# EAGLE design polarshield_eagle1.5_auto (EAGLE 5.11)
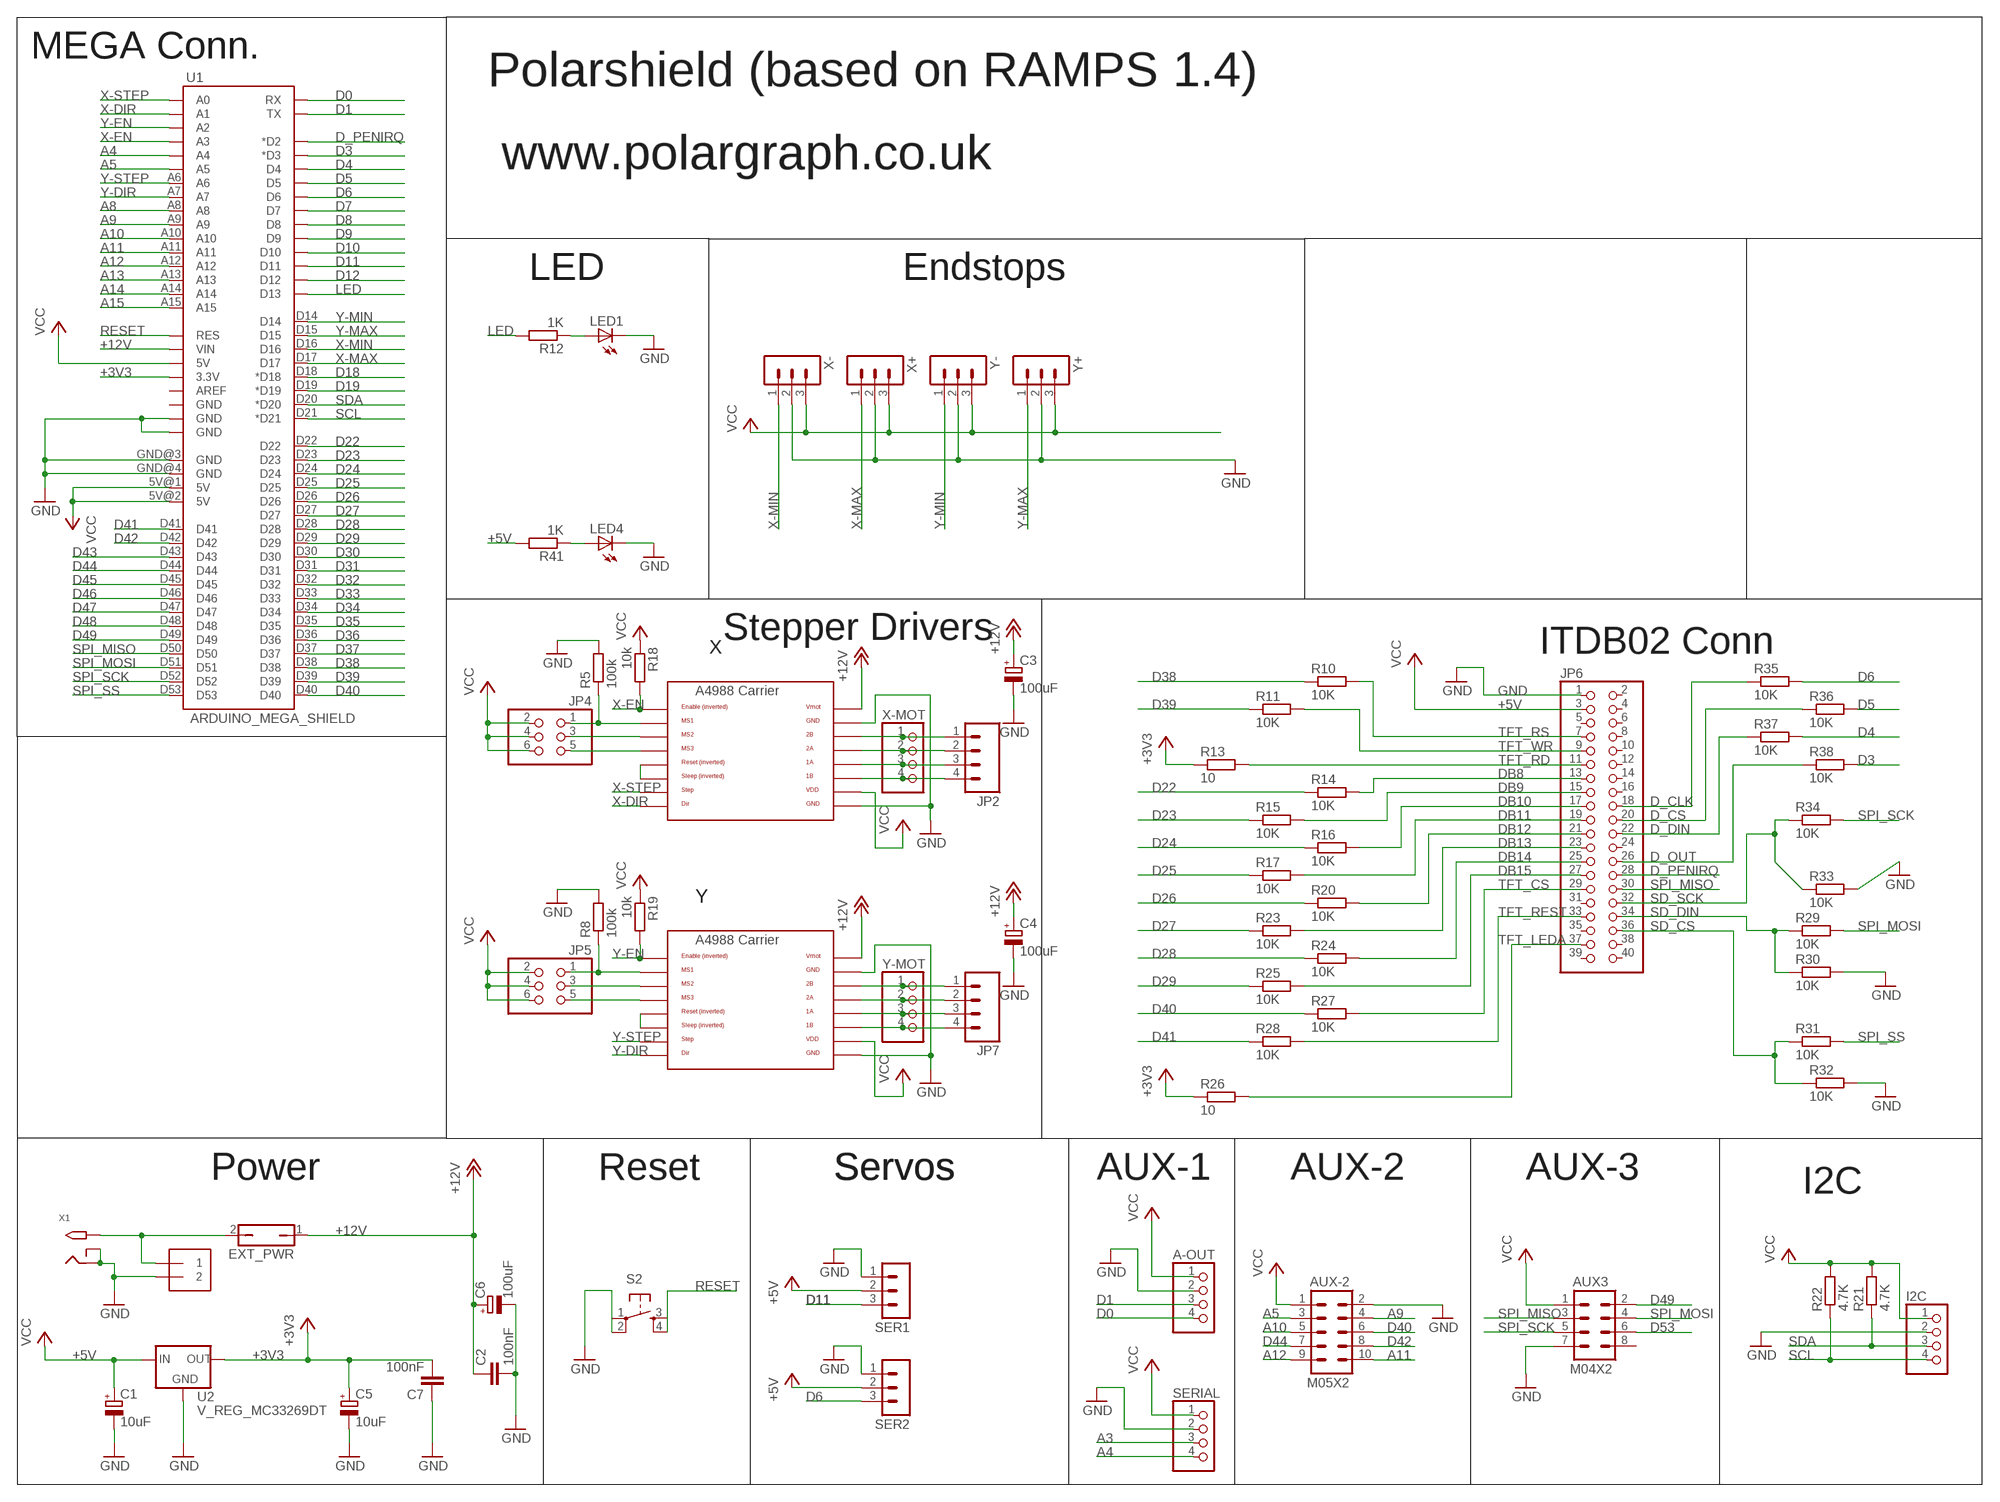
[diagram p0: schematic, sheet 1, part 1 of 2]
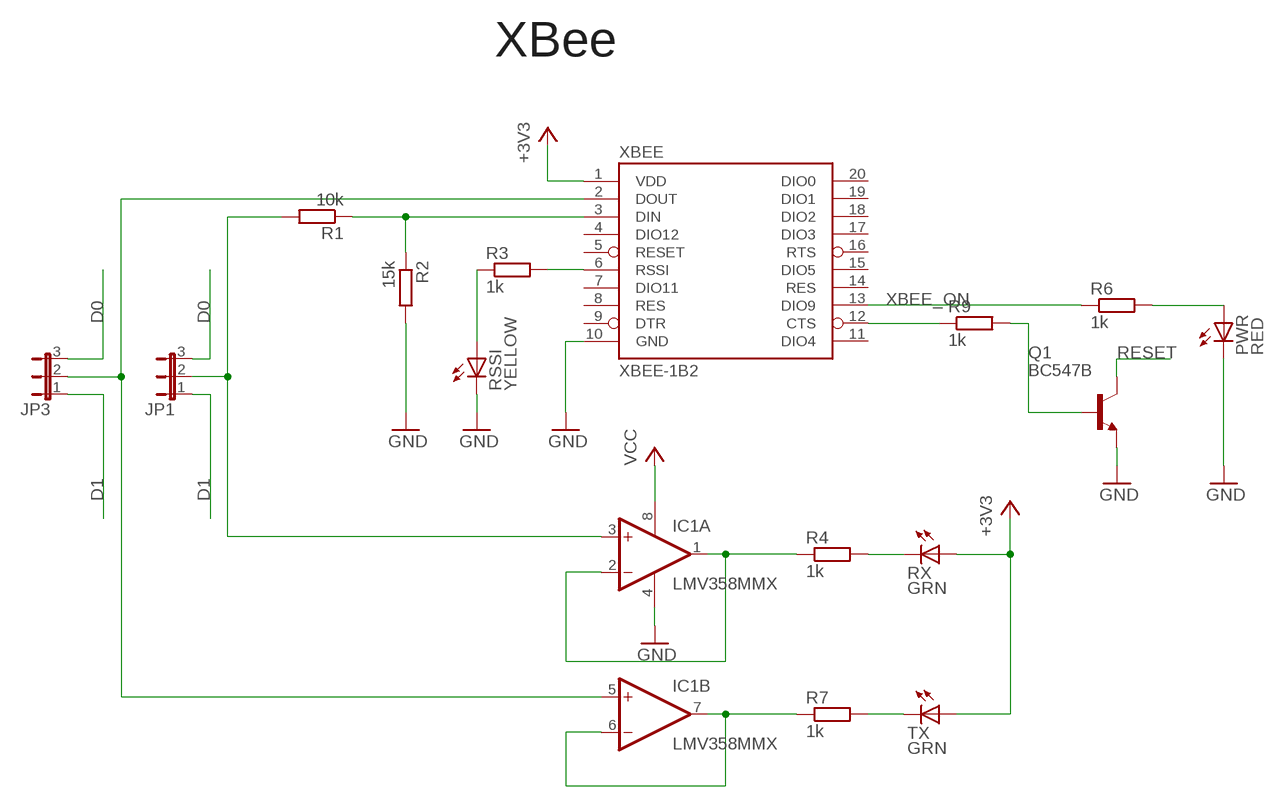
[diagram p1: schematic, sheet 1, part 2 of 2]

## Parts
A-OUT  PINHD-1X4  [1X04]
AUX3  M04X2  [2X4]
AUX-2  M05X2  [2X5]
C1  10uF  CPOL-EUCT7343  [CT7343]
C2  100nF  C-EUC0805  [C0805]
C3  100uF  CPOL-EU153CLV-0605  [153CLV-0605]
C4  100uF  CPOL-EU153CLV-0605  [153CLV-0605]
C5  10uF  CPOL-EUCT7343  [CT7343]
C6  100uF  CPOL-EU153CLV-0605  [153CLV-0605]
C7  100nF  C-EUC0805  [C0805]
EXT_PWR  JP1Q  [JP1]
I2C  PINHD-1X4  [1X04]
IC1  LMV358MMX  [MSOP08]
J1  1X2-3.5MM  [1X2-3.5MM]
JP1  JP2E  [JP2]
JP2  M04SCREW  [SCREWTERMINAL-3.5MM-4]
JP3  JP2E  [JP2]
JP4  PINHD-2X3  [2X03]
JP5  PINHD-2X3  [2X03]
JP6  PINHD-2X20  [2X20]
JP7  M04SCREW  [SCREWTERMINAL-3.5MM-4]
LED1  LEDCHIP-LED0805  [CHIP-LED0805]
LED4  LEDCHIP-LED0805  [CHIP-LED0805]
PWR  RED  LEDCHIPLED_0805  [CHIPLED_0805]
Q1  BC547B  [TO92]
R1  10k  R-EU_R0805  [R0805]
R2  15k  R-EU_R0805  [R0805]
R3  1k  R-EU_R0805  [R0805]
R4  1k  R-EU_R0805  [R0805]
R5  100k  R-EU_R0805  [R0805]
R6  1k  R-EU_R0805  [R0805]
R7  1k  R-EU_R0805  [R0805]
R8  100k  R-EU_R0805  [R0805]
R9  1k  R-EU_R0805  [R0805]
R10  10K  R-EU_R0805  [R0805]
R11  10K  R-EU_R0805  [R0805]
R12  1K  R-EU_R0805  [R0805]
R13  10  R-EU_R0805  [R0805]
R14  10K  R-EU_R0805  [R0805]
R15  10K  R-EU_R0805  [R0805]
R16  10K  R-EU_R0805  [R0805]
R17  10K  R-EU_R0805  [R0805]
R18  10k  R-EU_R0805  [R0805]
R19  10k  R-EU_R0805  [R0805]
R20  10K  R-EU_R0805  [R0805]
R21  4.7K  R-EU_R0805  [R0805]
R22  4.7K  R-EU_R0805  [R0805]
R23  10K  R-EU_R0805  [R0805]
R24  10K  R-EU_R0805  [R0805]
R25  10K  R-EU_R0805  [R0805]
R26  10  R-EU_R0805  [R0805]
R27  10K  R-EU_R0805  [R0805]
R28  10K  R-EU_R0805  [R0805]
R29  10K  R-EU_R0805  [R0805]
R30  10K  R-EU_R0805  [R0805]
R31  10K  R-EU_R0805  [R0805]
R32  10K  R-EU_R0805  [R0805]
R33  10K  R-EU_R0805  [R0805]
R34  10K  R-EU_R0805  [R0805]
R35  10K  R-EU_R0805  [R0805]
R36  10K  R-EU_R0805  [R0805]
R37  10K  R-EU_R0805  [R0805]
R38  10K  R-EU_R0805  [R0805]
R41  1K  R-EU_R0805  [R0805]
RSSI  YELLOW  LEDCHIPLED_0805  [CHIPLED_0805]
RX  GRN  LEDCHIPLED_0805  [CHIPLED_0805]
S2  TAC_SWITCHPTH  [TACTILE-PTH]
SER1  3PIN-HEADER  [3PIN-HEADER]
SER2  3PIN-HEADER  [3PIN-HEADER]
SERIAL  PINHD-1X4  [1X04]
TX  GRN  LEDCHIPLED_0805  [CHIPLED_0805]
U1  ARDUINO_MEGA_SHIELD  [ARDUINO_MEGA_SHIELD]
U2  V_REG_MC33269DT  [DPAK]
U$6  A4988BREAKOUT  [A4988BREAKOUT]
U$7  A4988BREAKOUT  [A4988BREAKOUT]
X1  2.1MMJACKTHM  [PJ-102A]
X+  3PIN-HEADER  [3PIN-HEADER]
X-  3PIN-HEADER  [3PIN-HEADER]
X-MOT  PINHD-1X4  [1X04]
XBEE  XBEE-1B2  [XBEE-SILK]
Y+  3PIN-HEADER  [3PIN-HEADER]
Y-  3PIN-HEADER  [3PIN-HEADER]
Y-MOT  PINHD-1X4  [1X04]

## Nets
+3V3: C5.+ C7.2 R13.1 R26.1 RX.A TX.A U1.3.3V U2.4(OUT) XBEE.1(VDD)
+5V: A-OUT.1 AUX3.1 AUX-2.1 C1.+ I2C.1 IC1.8(P:V+) JP4.2 JP4.4 JP4.6 JP5.2 JP5.4 JP5.6 JP6.3 R18.1 R19.1 R21.2 R22.2 R41.2 SER1.2 SER2.2 SERIAL.1 U1.5V@0(5V) U1.5V@1(5V) U1.5V@2(5V) U2.3(IN) U$6.VDD U$7.VDD X+.3 X-.3 Y+.3 Y-.3 ; supply symbol labelled VCC
+12V: C2.1 C3.+ C4.+ C6.+ EXT_PWR.1 U1.VIN U$6.VMOT U$7.VMOT
A3: SERIAL.3
A4: SERIAL.4 U1.A4
A5: AUX-2.3 U1.A5
A8: U1.A8
A9: AUX-2.4 U1.A9
A10: AUX-2.5 U1.A10
A11: AUX-2.10 U1.A11
A12: AUX-2.9 U1.A12
A13: U1.A13
A14: U1.A14
A15: U1.A15
D0: A-OUT.4 JP1.3 JP3.3 U1.RX
D1: A-OUT.3 JP1.1 JP3.1 U1.TX
D3: R38.2 U1.D3(*D3)
D4: R37.2 U1.D4
D5: R36.2 U1.D5
D6: R35.2 SER2.3 U1.D6
D7: U1.D7
D8: U1.D8
D9: U1.D9
D10: U1.D10
D11: SER1.3 U1.D11
D12: U1.D12
D18: U1.D18(*D18)
D19: U1.D19(*D19)
D22: R14.1 U1.D22
D23: R15.1 U1.D23
D24: R16.1 U1.D24
D25: R17.1 U1.D25
D26: R20.1 U1.D26
D27: R23.1 U1.D27
D28: R24.1 U1.D28
D29: R25.1 U1.D29
D30: U1.D30
D31: U1.D31
D32: U1.D32
D33: U1.D33
D34: U1.D34
D35: U1.D35
D36: U1.D36
D37: U1.D37
D38: R10.1 U1.D38
D39: R11.1 U1.D39
D40: AUX-2.6 R27.1 U1.D40
D41: R28.1 U1.D41
D42: AUX-2.8 U1.D42
D43: U1.D43
D44: AUX-2.7 U1.D44
D45: U1.D45
D46: U1.D46
D47: U1.D47
D48: U1.D48
D49: AUX3.2 U1.D49
D53: AUX3.6
D_CLK: JP6.18 R35.1
D_CS: JP6.20 R36.1
D_DIN: JP6.22 R37.1
D_OUT: JP6.26 R38.1
D_PENIRQ: JP6.28 U1.D2(*D2)
DB8: JP6.13 R14.2
DB9: JP6.15 R15.2
DB10: JP6.17 R16.2
DB11: JP6.19 R17.2
DB12: JP6.21 R20.2
DB13: JP6.23 R23.2
DB14: JP6.25 R24.2
DB15: JP6.27 R25.2
GND: A-OUT.2 AUX3.7 AUX-2.2 C1.- C2.2 C3.- C4.- C5.- C6.- C7.1 I2C.2 IC1.4(P:V-) J1.2 JP6.1 LED1.C LED4.C PWR.C Q1.1(E) R2.2 R5.2 R8.2 R30.2 R32.2 R33.2 RSSI.C S2.1 S2.2 SER1.1 SER2.1 SERIAL.2 U1.GND@0(GND) U1.GND@1(GND) U1.GND@3(GND) U1.GND@4(GND) U2.1(GND) U$6.GND U$6.GND@0(GND) U$7.GND U$7.GND@0(GND) X1.RING X1.RING_SW X+.2 X-.2 XBEE.10(GND) Y+.2 Y-.2
LED: R12.2 U1.D13
N$2: LED4.A R41.1
N$3: EXT_PWR.2 J1.1 X1.TIP
N$4: R7.2 TX.C
N$5: R3.1 RSSI.A
N$6: IC1.6(B:-IN) IC1.7(B:OUT) R7.1
N$7: PWR.A R6.2
N$8: R3.2 XBEE.6(RSSI)
N$9: IC1.1(A:OUT) IC1.2(A:-IN) R4.1
N$10: R9.1 XBEE.12(CTS)
N$11: R4.2 RX.C
N$12: Q1.2(B) R9.2
N$14: JP4.1 R5.1 U$6.MS1
N$15: JP4.3 U$6.MS2
N$16: IC1.3(A:+IN) JP1.2 R1.2
N$17: JP5.3 U$7.MS2
N$19: JP4.5 U$6.MS3
N$20: U$6.RST U$6.SLP(SLEEP)
N$21: JP2.1 U$6.2B X-MOT.1
N$22: JP2.2 U$6.2A X-MOT.2
N$23: U$7.RST U$7.SLP(SLEEP)
N$24: IC1.5(B:+IN) JP3.2 XBEE.2(DOUT)
N$26: JP2.3 U$6.1A X-MOT.3
N$27: JP2.4 U$6.1B X-MOT.4
N$28: JP7.1 U$7.2B Y-MOT.1
N$29: JP7.2 U$7.2A Y-MOT.2
N$30: JP7.3 U$7.1A Y-MOT.3
N$31: JP5.5 U$7.MS3
N$32: R1.1 R2.1 XBEE.3(DIN)
N$33: JP5.1 R8.1 U$7.MS1
N$36: JP7.4 U$7.1B Y-MOT.4
N$46: LED1.A R12.1
RESET: Q1.3(C) S2.3 S2.4 U1.RES
SCL: I2C.4 R22.1 U1.D21(*D21)
SD_CS: JP6.36 R31.1 R32.1
SD_DIN: JP6.34 R29.1 R30.1
SD_SCK: JP6.32 R33.1 R34.1
SDA: I2C.3 R21.1 U1.D20(*D20)
SPI_MISO: AUX3.3 JP6.30 U1.D50
SPI_MOSI: AUX3.4 R29.2 U1.D51
SPI_SCK: AUX3.5 R34.2 U1.D52
SPI_SS: R31.2 U1.D53
TFT_CS: JP6.29 R27.2
TFT_LEDA: JP6.37 R26.2
TFT_RD: JP6.11 R13.2
TFT_REST: JP6.33 R28.2
TFT_RS: JP6.7 R10.2
TFT_WR: JP6.9 R11.2
X-DIR: U1.A1 U$6.DIR
X-EN: R18.2 U1.A3 U$6.EN
X-MAX: U1.D17 X+.1
X-MIN: U1.D16 X-.1
X-STEP: U1.A0 U$6.STEP
XBEE_ON: R6.1 XBEE.13(DIO9)
Y-DIR: U1.A7 U$7.DIR
Y-EN: R19.2 U1.A2 U$7.EN
Y-MAX: U1.D15 Y+.1
Y-MIN: U1.D14 Y-.1
Y-STEP: U1.A6 U$7.STEP
Unconnected: AUX3.8 JP6.2 JP6.4 JP6.5 JP6.6 JP6.8 JP6.10 JP6.12 JP6.14 JP6.16 JP6.24 JP6.31 JP6.35 JP6.38 JP6.39 JP6.40 U1.AREF U1.GND@2(GND) XBEE.4(DIO12) XBEE.5(RESET) XBEE.7(DIO11) XBEE.8(RES) XBEE.9(DTR) XBEE.11(DIO4) XBEE.14(RES) XBEE.15(DIO5) XBEE.16(RTS) XBEE.17(DIO3) XBEE.18(DIO2) XBEE.19(DIO1) XBEE.20(DIO0)

## Notes on the sheet
- MEGA Conn.
- Polarshield (based on RAMPS 1.4)
- www.polargraph.co.uk
- LED | Endstops
- XBee
- Stepper Drivers
- X | ITDB02 Conn
- Y
- Power | Reset | Servos | Servos | AUX-1 | AUX-2 | AUX-3
- I2C

## Library data of the parts
A-OUT I2C SERIAL X-MOT Y-MOT = RepRapjr:PINHD-1X4: PIN HEADER
AUX3 = SparkFun:M04X2
AUX-2 = RepRapjr:M05X2
C1 C3-C6 = rcl:CPOL-EU: POLARIZED CAPACITOR, European symbol
C2 C7 = resistor:C-EU: CAPACITOR, European symbol
EXT_PWR = jumper:JP1Q: JUMPER
IC1 = linear:LMV358?*: Dual General Purpose, Low Voltage, Rail-to-Rail Output Operational Amplifiers Source: http://www.national.com/mpf/LM/LMV321.html http://www.national.com/dt/lmv_qual.pdf
J1 = adafruit:1X2: 3.5mm Terminal block http://www.ladyada.net/library/pcb/eaglelibrary.html
JP1 JP3 = jumper:JP2E: JUMPER
JP2 JP7 = SparkFun:M04: Header 4 Standard 4-pin 0.1" header. Use with straight break away headers (SKU : PRT-00116), right angle break away headers (PRT-00553), swiss pins (PRT-00743), machine pins (PRT-00117), and female headers (PRT-00115). Molex polarized connector foot print use with SKU : PRT-08231 with associated crimp pins and housings. 1MM SMD Version SKU: PRT-10208
JP4 JP5 = pinhead:PINHD-2X3: PIN HEADER
JP6 = pinhead:PINHD-2X20: PIN HEADER
LED1 LED4 PWR RSSI RX TX = led:LED: LED OSRAM: - CHIPLED LG R971, LG N971, LY N971, LG Q971, LY Q971, LO R971, LY R971 LH N974, LH R974 LS Q976, LO Q976, LY Q976 LO Q996 - Hyper CHIPLED LW Q18S LB Q993, LB Q99A, LB R99A - SideLED LS A670, LO A670, LY A670, LG A670, LP A670 LB A673, LV A673, LT A673, LW A673 LH A674 LY A675 LS A676, LA A676, LO A676, LY A676, LW A676 LS A679, LY A679, LG A679 - Hyper Micro SIDELED® LS Y876, LA Y876, LO Y876, LY Y876 LT Y87S - SmartLED LW L88C, LW L88S LB L89C, LB L89S, LG L890 LS L89K, LO L89K, LY L89K LS L896, LA L896, LO L896, LY L896 - TOPLED LS T670, LO T670, LY T670, LG T670, LP T670 LSG T670, LSP T670, LSY T670, LOP T670, LYG T670 LG T671, LOG T671, LSG T671 LB T673, LV T673, LT T673, LW T673 LH T674 LS T676, LA T676, LO T676, LY T676, LB T676, LH T676, LSB T676, LW T676 LB T67C, LV T67C, LT T67C, LS T67K, LO T67K, LY T67K, LW E67C LS E67B, LA E67B, LO E67B, LY E67B, LB E67C, LV E67C, LT E67C LW T67C LS T679, LY T679, LG T679 LS T770, LO T770, LY T770, LG T770, LP T770 LB T773, LV T773, LT T773, LW T773 LH T774 LS E675, LA E675, LY E675, LS T675 LS T776, LA T776, LO T776, LY T776, LB T776 LHGB T686 LT T68C, LB T68C - Hyper Mini TOPLED® LB M676 - Mini TOPLED Santana® LG M470 LS M47K, LO M47K, LY M47K Source: http://www.osram.convergy.de LUXEON: - LUMILED® LXK2-PW12-R00, LXK2-PW12-S00, LXK2-PW14-U00, LXK2-PW14-V00 LXK2-PM12-R00, LXK2-PM12-S00, LXK2-PM14-U00 LXK2-PE12-Q00, LXK2-PE12-R00, LXK2-PE12-S00, LXK2-PE14-T00, LXK2-PE14-U00 LXK2-PB12-K00, LXK2-PB12-L00, LXK2-PB12-M00, LXK2-PB14-N00, LXK2-PB14-P00, LXK2-PB14-Q00 LXK2-PR12-L00, LXK2-PR12-M00, LXK2-PR14-Q00, LXK2-PR14-R00 LXK2-PD12-Q00, LXK2-PD12-R00, LXK2-PD12-S00 LXK2-PH12-R00, LXK2-PH12-S00 LXK2-PL12-P00, LXK2-PL12-Q00, LXK2-PL12-R00 Source: www.luxeon.com KINGBRIGHT: KA-3528ASYC Source: www.kingbright.com
Q1 = transistor-npn:BC547*: NPN Transistor
R1 R2 R5 R8 R12 R18 R19 R21 R22 R41 = rcl:R-EU_: RESISTOR, European symbol
R3 R4 R6 R7 R9-R11 R13-R17 R20 R23-R38 = resistor:R-EU_: RESISTOR, European symbol
S2 = SparkFun:TAC_SWITCH: Momentary Switch Button commonly used for reset or general input. Spark Fun Electronics SKU : COM-00097
SER1 SER2 X+ X- Y+ Y- = ultimachine:3PIN-HEADER: PIN HEADER
U1 = RepRapjr:ARDUINO_MEGA_SHIELD
U2 = SparkFun:V_REG_MC33269
U$6 U$7 = RepRapjr:A4988BREAKOUT
X1 = adafruit:2.1MMJACK: 2.1mm x 5.5mm THM DC jack with internal switch. Digikey part #PJ-102A, 4UCON part #05537 2.1mm x 5.5mm SMT DC jack with internal switch. Digikey part #PJ-002A-SMT, 4UCON part #03267 By microbuilder.eu & adafruit.com
XBEE = SparkFun:XBEE-1

## Net classes
1 gnd12: width 2.1 mm

## Board
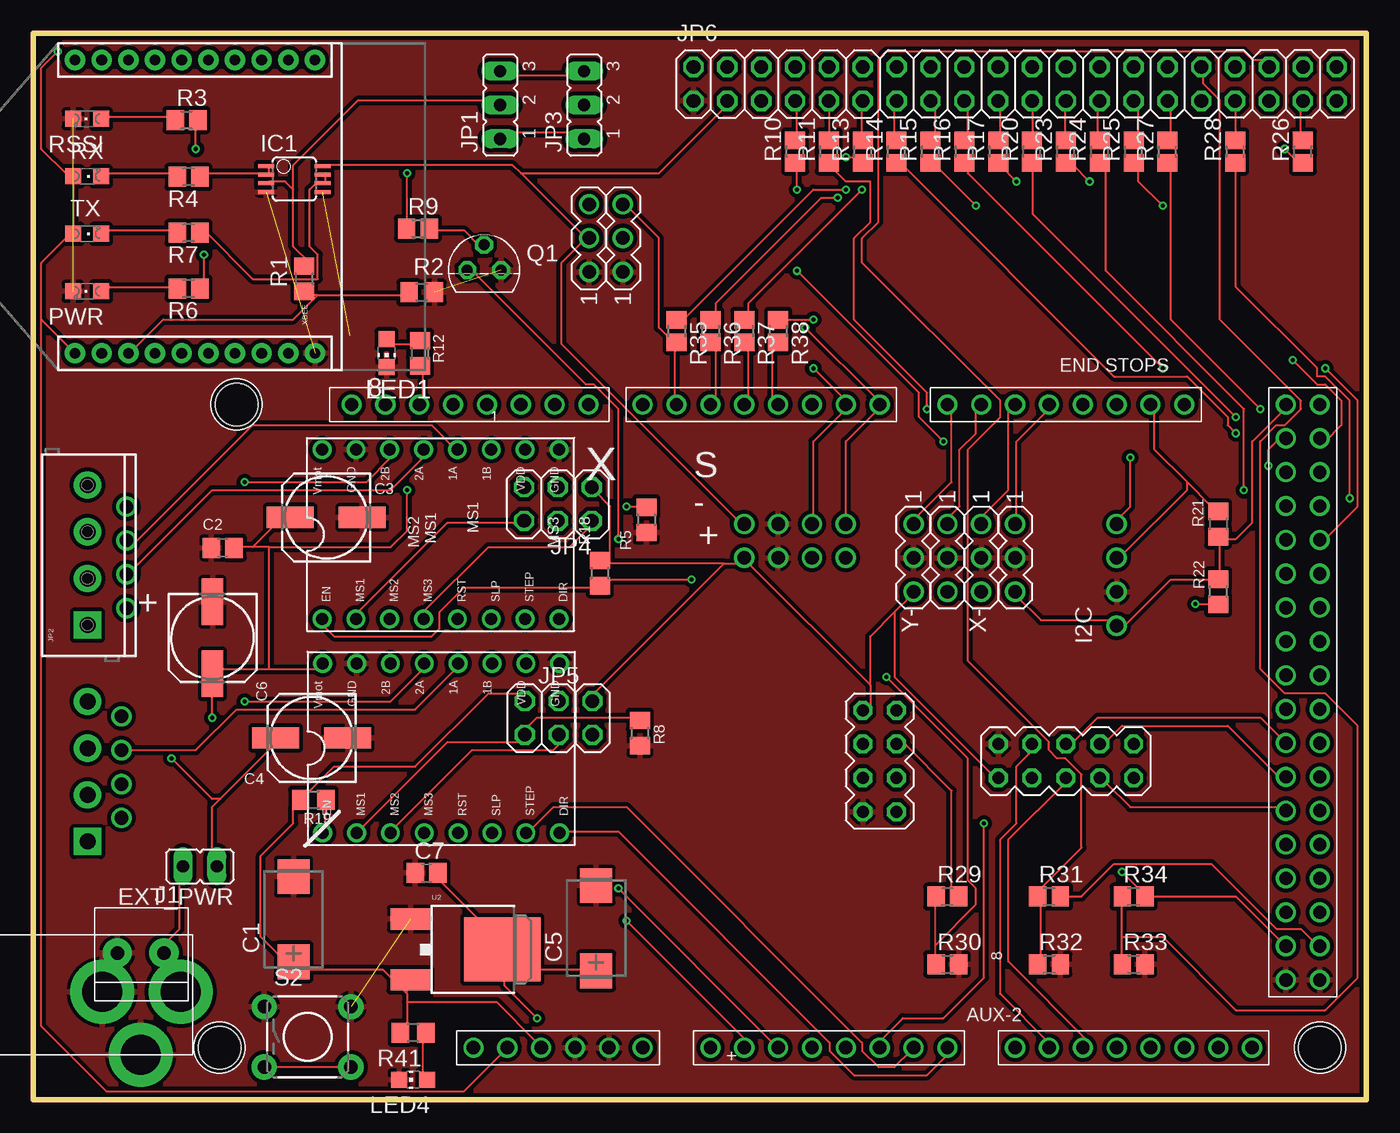
[diagram p2: board, top side]
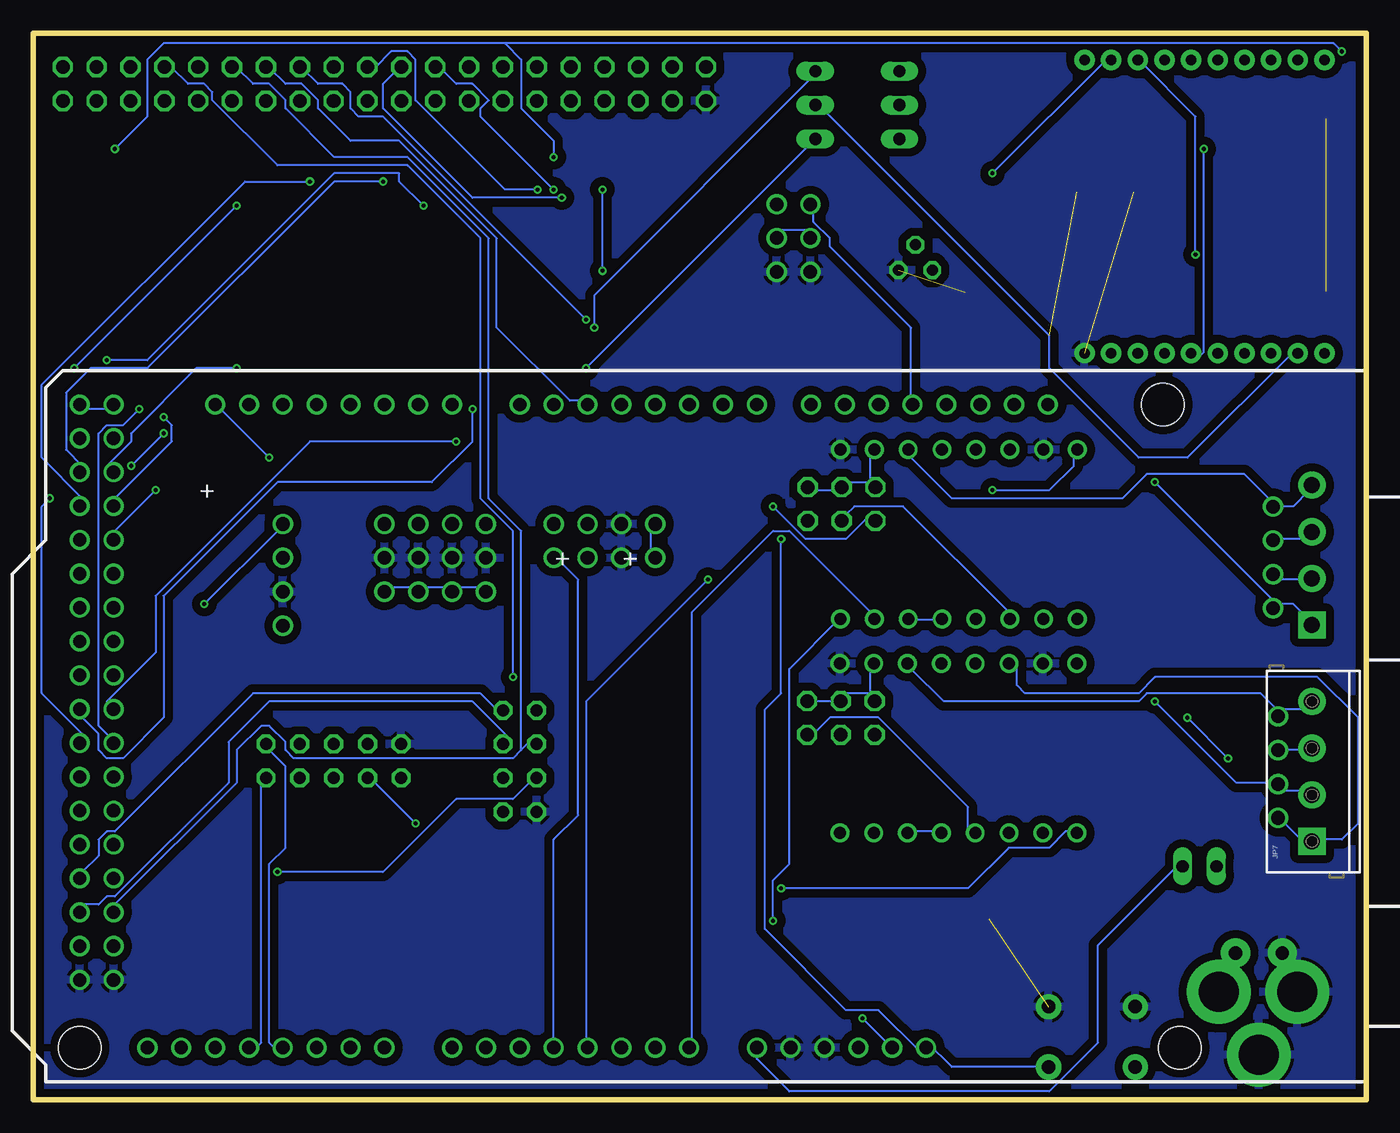
[diagram p3: board, bottom side, seen from below]

Size 100 x 80 mm. Coordinates in mm from the lower left corner, seen from the top.
Outline: 0,0 100,0 100,80 0,80 0,0
Copper layers (1*16): Top 0.035mm / dielectric 1.5mm / Bottom 0.035mm
Design rules "ITead_rule": minimum track width 6mil, minimum drill 12mil, track to track 6mil, track to pad 6mil, pad to pad 6mil, via to via 6mil, smd to smd 0mil, copper to edge 10mil, drill to drill 10mil, minimum pad ring 10mil, minimum via ring 6mil, stop-mask expansion 2mil, vias tented up to drill 100mil, thermal gap 10mil

### Footprints (pad centres in the part's own frame; a part is rotated, then mirrored left to right if it is on the bottom)
1X04 = drill 1.016 round: 1 -2.54,0; 2 0,0; 3 2.54,0; 4 5.08,0
2X4 = drill 0.9 pad 1.422 octagon: 1 -3.81,-1.27; 2 -3.81,1.27; 3 -1.27,-1.27; 4 -1.27,1.27; 5 1.27,-1.27; 6 1.27,1.27; 7 3.81,-1.27; 8 3.81,1.27
2X5 = drill 0.9 pad 1.422 octagon: 1 -3.81,-1.27; 2 -3.81,1.27; 3 -1.27,-1.27; 4 -1.27,1.27; 5 1.27,-1.27; 6 1.27,1.27; 7 3.81,-1.27; 8 3.81,1.27; 9 6.35,-1.27; 10 6.35,1.27
CT7343 = smd 2.6 x 2.4: + -3.2,0; - 3.2,0
C0805 = smd 1.3 x 1.5: 1 -0.85,0; 2 0.85,0
153CLV-0605 = smd 3.5 x 1.6: + 2.7,0; - -2.7,0
JP1 = drill 0.914 long: 1 0,-1.27; 2 0,1.27
MSOP08 = smd 0.3 x 1.2: 1 -0.976,-2.113; 2 -0.326,-2.113; 3 0.324,-2.113; 4 0.974,-2.113; 5 0.974,2.112; 6 0.324,2.112; 7 -0.326,2.112; 8 -0.976,2.112
1X2-3.5MM = drill 1 pad 2.184 round: 1 1.8,0; 2 -1.7,0
JP2 = drill 0.914 long: 1 -2.54,0; 2 0,0; 3 2.54,0
SCREWTERMINAL-3.5MM-4 = drill 1.2 pad 2.032 square: 1 0,0 | drill 1.2 pad 2.032 round: 2 3.5,0; 3 7,0; 4 10.5,0
2X03 = drill 1.016 octagon: 1 -2.54,-1.27; 2 -2.54,1.27; 3 0,-1.27; 4 0,1.27; 5 2.54,-1.27; 6 2.54,1.27
2X20 = drill 1.016 octagon: 1 -24.13,-1.27; 2 -24.13,1.27; 3 -21.59,-1.27; 4 -21.59,1.27; 5 -19.05,-1.27; 6 -19.05,1.27; 7 -16.51,-1.27; 8 -16.51,1.27; 9 -13.97,-1.27; 10 -13.97,1.27; 11 -11.43,-1.27; 12 -11.43,1.27; 13 -8.89,-1.27; 14 -8.89,1.27; 15 -6.35,-1.27; 16 -6.35,1.27; 17 -3.81,-1.27; 18 -3.81,1.27; 19 -1.27,-1.27; 20 -1.27,1.27; 21 1.27,-1.27; 22 1.27,1.27; 23 3.81,-1.27; 24 3.81,1.27; 25 6.35,-1.27; 26 6.35,1.27; 27 8.89,-1.27; 28 8.89,1.27; 29 11.43,-1.27; 30 11.43,1.27; 31 13.97,-1.27; 32 13.97,1.27; 33 16.51,-1.27; 34 16.51,1.27; 35 19.05,-1.27; 36 19.05,1.27; 37 21.59,-1.27; 38 21.59,1.27; 39 24.13,-1.27; 40 24.13,1.27
CHIP-LED0805 = smd 1.2 x 1.2: A 0,-1.05; C 0,1.05
CHIPLED_0805 = smd 1.2 x 1.2: A 0,-1.05; C 0,1.05
TO92 = drill 0.813 octagon: 1 1.27,0; 2 0,1.905; 3 -1.27,0
R0805 = smd 1.3 x 1.5: 1 -0.95,0; 2 0.95,0
R0805' = smd 1.3 x 1.5: 1 -0.85,0; 2 0.85,0
TACTILE-PTH = drill 1.016 pad 1.88 round: 1 -3.251,2.261; 2 3.251,2.261; 3 -3.251,-2.261; 4 3.251,-2.261
3PIN-HEADER = drill 1.016 round: 1 -2.54,0; 2 0,0; 3 2.54,0
ARDUINO_MEGA_SHIELD = drill 1 pad 1.422 round: 3.3V 35.56,2.54; 5V@0 38.1,2.54; 5V@1 93.98,50.8; 5V@2 96.52,50.8; A0 50.8,2.54; A1 53.34,2.54; A2 55.88,2.54; A3 58.42,2.54; A4 60.96,2.54; A5 63.5,2.54; A6 66.04,2.54; A7 68.58,2.54; A8 73.66,2.54; A9 76.2,2.54; A10 78.74,2.54; A11 81.28,2.54; A12 83.82,2.54; A13 86.36,2.54; A14 88.9,2.54; A15 91.44,2.54; AREF 23.876,50.8; D2 58.42,50.8; D3 55.88,50.8; D4 53.34,50.8; D5 50.8,50.8; D6 48.26,50.8; D7 45.72,50.8; D8 41.656,50.8; D9 39.116,50.8; D10 36.576,50.8; D11 34.036,50.8; D12 31.496,50.8; D13 28.956,50.8; D14 68.58,50.8; D15 71.12,50.8; D16 73.66,50.8; D17 76.2,50.8; D18 78.74,50.8; D19 81.28,50.8; D20 83.82,50.8; D21 86.36,50.8; D22 93.98,48.26; D23 96.52,48.26; D24 93.98,45.72; D25 96.52,45.72; D26 93.98,43.18; D27 96.52,43.18; D28 93.98,40.64; D29 96.52,40.64; D30 93.98,38.1; D31 96.52,38.1; D32 93.98,35.56; D33 96.52,35.56; D34 93.98,33.02; D35 96.52,33.02; D36 93.98,30.48; D37 96.52,30.48; D38 93.98,27.94; D39 96.52,27.94; D40 93.98,25.4; D41 96.52,25.4; D42 93.98,22.86; D43 96.52,22.86; D44 93.98,20.32; D45 96.52,20.32; D46 93.98,17.78; D47 96.52,17.78; D48 93.98,15.24; D49 96.52,15.24; D50 93.98,12.7; D51 96.52,12.7; D52 93.98,10.16; D53 96.52,10.16; GND@0 40.64,2.54; GND@1 43.18,2.54; GND@2 26.416,50.8; GND@3 93.98,7.62; GND@4 96.52,7.62; RES 33.02,2.54; RX 63.5,50.8; TX 60.96,50.8; VIN 45.72,2.54 | hole 3.2: 96.52,2.54; 13.97,2.54; 15.24,50.8
DPAK = smd 1.6 x 3: 1 -2.28,-5.31; 3 2.28,-5.31 | smd 4.826 x 5.715: 4 0,1.588
A4988BREAKOUT = drill 0.9 round: 1A 8.89,1.27; 1B 11.43,1.27; 2A 6.35,1.27; 2B 3.81,1.27; DIR 16.51,-11.43; EN -1.27,-11.43; GND 16.51,1.27; GND@0 1.27,1.27; MS1 1.27,-11.43; MS2 3.81,-11.43; MS3 6.35,-11.43; RST 8.89,-11.43; SLP 11.43,-11.43; STEP 13.97,-11.43; VDD 13.97,1.27; VMOT -1.27,1.27
PJ-102A = drill 3 pad 4.8 round: RING 0.1,-3.39; RING_SW -4.6,-6.29; TIP 0.1,-9.29
XBEE-SILK = drill 0.8 pad 1.524 round: 1 -11,20; 2 -11,18; 3 -11,16; 4 -11,14; 5 -11,12; 6 -11,10; 7 -11,8; 8 -11,6; 9 -11,4; 10 -11,2; 11 11,2; 12 11,4; 13 11,6; 14 11,8; 15 11,10; 16 11,12; 17 11,14; 18 11,16; 19 11,18; 20 11,20

### Placement (x,y rotation side)
A-OUT  55.88,43.18 0 top
AUX3  63.5,25.4 270 top
AUX-2  76.2,25.4 0 top
C1  19.52,13.53 90 top
C2  14.21,41.39 180 top
C3  21.97,43.68 180 top
C4  20.89,27.13 180 top
C5  42.23,12.86 90 top
C6  13.44,34.64 270 top
C7  29.5,17 0 top
EXT_PWR  12.5,17.5 90 top
I2C  81.28,38.1 90 top
IC1  19.58,69.07 270 top
J1  8,11 0 top
JP1  35.02,74.62 90 top
JP2  4.06,35.6 90 top
JP3  41.33,74.62 90 top
JP4  39.36,44.68 0 top
JP5  39.41,28.63 0 top
JP6  73.66,76.2 0 top
JP7  4.06,19.36 90 bottom
LED1  26.5,56 180 top
LED4  28.5,1.5 90 top
PWR  4.04,60.65 90 top
Q1  33.82,62.23 0 top
R1  20.34,61.59 90 top
R2  29.14,60.58 0 top
R3  1k  [R0805']  11.5,73.5 0 top
R4  1k  [R0805']  11.65,69.23 180 top
R5  46,43.5 270 top
R6  1k  [R0805']  11.65,60.85 180 top
R7  1k  [R0805']  11.65,65.04 180 top
R8  45.5,27.5 270 top
R9  1k  [R0805']  28.86,65.35 0 top
R10  10K  [R0805']  57.15,71.12 90 top
R11  10K  [R0805']  59.69,71.12 90 top
R12  29,56 270 top
R13  10  [R0805']  62.23,71.12 90 top
R14  10K  [R0805']  64.77,71.12 90 top
R15  10K  [R0805']  67.31,71.12 90 top
R16  10K  [R0805']  69.85,71.12 90 top
R17  10K  [R0805']  72.39,71.12 90 top
R18  42.5,39.5 270 top
R19  21,22.5 0 top
R20  10K  [R0805']  74.93,71.12 90 top
R21  88.9,43.18 270 top
R22  88.9,38.1 90 top
R23  10K  [R0805']  77.47,71.12 90 top
R24  10K  [R0805']  80.01,71.12 90 top
R25  10K  [R0805']  82.55,71.12 90 top
R26  10  [R0805']  95.25,71.12 90 top
R27  10K  [R0805']  85.09,71.12 90 top
R28  10K  [R0805']  90.17,71.12 90 top
R29  10K  [R0805']  68.58,15.24 0 top
R30  10K  [R0805']  68.58,10.16 0 top
R31  10K  [R0805']  76.2,15.24 0 top
R32  10K  [R0805']  76.2,10.16 0 top
R33  10K  [R0805']  82.55,10.16 0 top
R34  10K  [R0805']  82.55,15.24 0 top
R35  10K  [R0805']  48.26,57.66 270 top
R36  10K  [R0805']  50.8,57.66 270 top
R37  10K  [R0805']  53.34,57.66 270 top
R38  10K  [R0805']  55.88,57.66 270 top
R41  28.49,5 180 top
RSSI  4.04,73.58 90 top
RX  4.04,69.27 270 top
S2  20.57,4.7 0 top
SER1  41.7,64.63 90 top
SER2  44.24,64.64 90 top
SERIAL  55.88,40.64 0 top
TX  4.04,64.96 270 top
U1  0,1.35 0 top
U2  33.61,11.27 270 top
U$6  22.93,47.49 0 top
U$7  22.98,31.44 0 top
X1  1.77,7.97 90 top
X+  73.66,40.64 270 top
X-  71.12,40.64 270 top
X-MOT  6.99,39.41 90 top
XBEE  23.13,67 90 top
Y+  68.58,40.64 270 top
Y-  66.04,40.64 270 top
Y-MOT  6.6,23.67 90 top

### Tracks (layer width: path | path; a pad name or v marks a point on that pad's centre or on a via)
+3V3  (via drill 0.3)
  Top 0.152: C7.2 30.48,16.46 35.36,11.58 U2.4 35.36,10.97 | 35.36,10.97 36.58,9.75 42.06,9.75 C5.+ | v37.8,6.1 35.36,8.53 35.36,10.97 | 0.61,58.52 0.61,62.79 2.44,64.62 TX.A 3.05,65.23 3.05,68.89 RX.A 2.44,69.49 0.61,71.32 0.61,77.42 v1.83,78.64 | 0.61,58.52 3.05,56.08 XBEE.1 | v60.96,70.71 62.18,70.71 R13.1 | v93.88,71.32 95.1,70.1 R26.1 | 0.61,58.52 0.61,5.49 5.49,0.61 32.31,0.61 35.36,3.66 U1.3.3V
  Bottom 0.152: v37.8,6.1 35.97,4.27 U1.3.3V | v60.96,70.71 60.96,71.93 63.4,74.37 63.4,78.03 64.62,79.25 | 64.62,79.25 90.22,79.25 91.44,78.03 91.44,73.76 v93.88,71.32 | v1.83,78.64 2.44,79.25 64.62,79.25
+5V
  Top 0.152: 41.45,64.62 36.58,69.49 | 36.58,69.49 35.97,70.1 21.95,70.1 IC1.8 | 36.58,69.49 46.94,69.49 51.82,74.37 JP6.3 | 28.04,7.92 28.04,8.53 U2.3 | 28.04,7.92 28.04,7.32 | 28.04,7.32 28.04,5.49 R41.2 | 28.04,7.32 34.75,7.32 37.8,4.27 U1.5V@0 | 28.04,7.92 26.21,9.75 20.12,9.75 C1.+ 19.51,9.75 17.07,12.19 17.07,18.29 19.51,20.73 19.51,21.95 R19.1 20.12,22.55 22.55,24.99 28.65,24.99 34.14,30.48 36.58,30.48 JP5.2 | 51.82,40.23 53.03,40.23 SERIAL.1 53.65,40.23 62.79,31.09 | 51.82,40.23 43.28,40.23 | 43.28,40.23 42.67,40.23 R18.1 | 43.28,40.23 43.28,44.5 42.06,45.72 JP4.6 | 51.82,40.23 42.06,30.48 JP5.6 | 62.79,31.09 62.79,34.75 64.62,36.58 | 62.79,31.09 62.79,29.26 AUX3.1 | 64.62,36.58 65.84,37.8 Y-.3 | 64.62,36.58 64.62,31.7 71.93,24.38 AUX-2.1 | 89,42.06 89,39.62 R22.2 88.39,39.01 85.34,39.01 81.69,35.36 I2C.1 81.08,35.97 75.59,35.97 73.76,37.8 X+.3 | 89,42.06 90.22,42.06 91.44,43.28 91.44,49.38 93.88,51.82 U1.5V@1 | 89,42.06 R21.2 | 41.45,64.62 39.62,62.79 39.62,56.69 53.03,43.28 A-OUT.1 | 41.45,64.62 SER1.2
  Bottom 0.152: SER2.2 43.89,65.23 42.06,65.23 SER1.2 | 37.19,30.48 37.19,32.31 U$7.VDD | 37.19,30.48 39.01,30.48 JP5.4 39.62,29.87 41.45,29.87 JP5.6 | JP5.2 37.19,30.48 | 37.19,46.33 37.19,48.16 U$6.VDD | 37.19,46.33 39.01,46.33 JP4.4 39.62,45.72 41.45,45.72 JP4.6 | 37.19,46.33 JP4.2 | A-OUT.1 53.65,42.67 53.65,40.84 SERIAL.1 | X+.3 73.15,38.41 71.32,38.41 X-.3 70.71,38.41 68.89,38.41 Y+.3 68.28,38.41 66.45,38.41 Y-.3 | U1.5V@1 94.49,51.82 96.32,51.82 U1.5V@2
+12V  (via drill 0.3)
  Top 0.152: 17.68,32.31 14.02,32.31 C6.+ 13.41,31.7 v13.41,28.65 | 17.68,32.31 21.34,32.31 U$7.VMOT | 16.46,41.45 15.24,41.45 C2.1 | 16.46,41.45 18.9,43.89 C3.+ | v28.04,45.72 28.04,42.67 26.82,41.45 17.68,41.45 | 17.68,41.45 16.46,41.45 | 17.68,32.31 17.68,41.45 | 14.02,22.55 18.29,26.82 C4.+ | 14.02,22.55 13.41,21.95 13.41,17.68 EXT_PWR.1 | v10.36,25.6 13.41,22.55 14.02,22.55
  Bottom 0.152: v28.04,45.72 23.77,45.72 21.95,47.55 21.95,48.16 U$6.VMOT | U1.VIN 45.72,3.05 43.28,0.61 23.77,0.61 20.12,4.27 20.12,11.58 14.02,17.68 EXT_PWR.1 | v10.36,25.6 v13.41,28.65
A4
  Bottom 0.152: U1.A4 60.96,19.51 59.13,21.34 59.13,39.01 60.96,40.84 SERIAL.4
A5  (via drill 0.3)
  Top 0.152: v71.32,20.73 71.32,9.14 68.28,6.1 65.23,6.1 63.4,4.27 U1.A5
  Bottom 0.152: v71.32,20.73 74.37,23.77 AUX-2.3
A9
  Top 0.152: AUX-2.4 74.98,26.21 73.76,24.99 73.76,20.73 72.54,19.51 72.54,7.92 76.2,4.27 U1.A9
A10
  Top 0.152: AUX-2.5 77.42,23.77 73.15,19.51 73.15,10.36 79.25,4.27 U1.A10
A11
  Bottom 0.152: AUX-2.10 82.3,26.21 81.08,24.99 81.08,18.9 82.3,17.68 82.3,4.27 81.69,3.66 U1.A11
A12
  Bottom 0.152: AUX-2.9 82.91,23.77 82.91,4.27 83.52,3.66 U1.A12
D0  (via drill 0.3)
  Top 0.152: JP1.3 35.36,76.81 40.84,76.81 JP3.3 | A-OUT.4 60.96,49.38 63.4,51.82 U1.RX 63.4,52.43 v57.91,57.91
  Bottom 0.152: v57.91,57.91 57.91,60.35 41.45,76.81 JP3.3
D1  (via drill 0.3)
  Top 0.152: JP1.1 35.36,72.54 40.84,72.54 JP3.1 | A-OUT.3 58.52,43.28 58.52,49.38 60.96,51.82 U1.TX 60.96,52.43 v58.52,54.86
  Bottom 0.152: v58.52,54.86 41.45,71.93 JP3.1
D3
  Top 0.152: R38.2 55.47,56.69 55.47,52.43 U1.D3
D4
  Top 0.152: R37.2 53.65,56.69 53.65,52.43 U1.D4
D5
  Top 0.152: R36.2 51.21,56.69 51.21,52.43 U1.D5
D6
  Top 0.152: 48.16,56.69 48.16,52.43 U1.D6 | 48.16,56.69 46.94,57.91 46.94,64.62 44.5,67.06 SER2.3 | 48.16,56.69 R35.2
D11
  Bottom 0.152: U1.D11 34.14,52.43 34.14,57.91 40.23,64.01 40.23,64.62 41.45,65.84 41.45,67.06 SER1.3
D22  (via drill 0.3)
  Top 0.152: v90.22,49.99 89.61,50.6 89.61,51.21 86.56,54.25 81.08,54.25 65.23,70.1 R14.1 | v92.66,47.55 92.66,48.77 93.88,49.99 U1.D22
  Bottom 0.152: v90.22,49.99 v92.66,47.55
D23  (via drill 0.3)
  Top 0.152: v70.71,67.06 67.67,70.1 R15.1 | v94.49,55.47 96.32,53.65 96.93,53.65 98.15,52.43 98.15,50.6 96.93,49.38 U1.D23
  Bottom 0.152: v70.71,67.06 72.54,68.89 72.54,69.49 77.42,69.49 91.44,55.47 v94.49,55.47
D24  (via drill 0.3)
  Top 0.152: v84.73,54.86 70.1,69.49 70.1,70.1 R16.1
  Bottom 0.152: v84.73,54.86 87.78,54.86 92.66,49.99 92.66,49.38 94.49,47.55 U1.D24
D25  (via drill 0.3)
  Top 0.152: v73.76,68.89 72.54,70.1 R17.1
  Bottom 0.152: v73.76,68.89 77.42,68.89 91.44,54.86 95.71,54.86 97.54,53.03 97.54,48.77 96.32,47.55 U1.D25
D26  (via drill 0.3)
  Top 0.152: v90.22,51.21 74.98,66.45 74.98,70.1 R20.1
  Bottom 0.152: v90.22,51.21 89.61,50.6 89.61,49.38 93.88,45.11 U1.D26
D27  (via drill 0.3)
  Top 0.152: v79.25,68.89 78.03,70.1 R23.1
  Bottom 0.152: v79.25,68.89 84.12,68.89 99.36,53.65 99.36,48.16 96.32,45.11 U1.D27
D28  (via drill 0.3)
  Top 0.152: v90.83,45.72 90.83,51.82 80.47,62.18 80.47,70.1 R24.1
  Bottom 0.152: v90.83,45.72 94.49,42.06 U1.D28
D29  (via drill 0.3)
  Top 0.152: v84.73,67.06 82.91,68.89 82.91,70.1 R25.1 | v96.93,54.86 99.36,52.43 99.36,44.5 96.93,42.06 U1.D29
  Bottom 0.152: v96.93,54.86 v84.73,67.06
D38  (via drill 0.3)
  Top 0.152: v57.3,68.28 57.3,70.1 R10.1 | v57.3,62.18 66.45,53.03 66.45,51.21 v68.28,49.38
  Bottom 0.152: v57.3,62.18 v57.3,68.28 | v68.28,49.38 79.25,49.38 90.83,37.8 90.83,33.53 94.49,29.87 94.49,29.26 U1.D38
D39  (via drill 0.3)
  Top 0.152: v67.06,51.82 67.06,53.03 61.57,58.52 61.57,64.62 62.79,65.84 62.79,68.89 60.96,68.89 59.74,70.1 R11.1
  Bottom 0.152: v67.06,51.82 67.06,49.38 70.1,46.33 81.69,46.33 90.22,37.8 90.22,28.65 93.27,25.6 94.49,25.6 95.1,26.21 95.1,27.43 96.93,29.26 U1.D39
D40  (via drill 0.3)
  Top 0.152: v92.05,51.82 85.34,58.52 85.34,70.1 R27.1 | AUX-2.6 78.03,26.82 79.86,28.65 92.05,28.65 93.88,26.82 U1.D40
  Bottom 0.152: v92.05,51.82 93.27,50.6 94.49,50.6 95.1,49.99 95.1,28.04 93.88,26.82 U1.D40
D41  (via drill 0.3)
  Top 0.152: v98.75,45.11 98.75,52.43 96.93,54.25 96.32,54.25 96.32,54.86 90.22,60.96 90.22,70.1 R28.1
  Bottom 0.152: v98.75,45.11 99.36,44.5 99.36,30.48 96.32,27.43 96.32,26.82 U1.D41
D42
  Top 0.152: AUX-2.8 80.47,26.82 81.69,28.04 89.61,28.04 93.88,23.77 U1.D42
D44
  Top 0.152: AUX-2.7 80.47,23.77 82.3,21.95 93.88,21.95 U1.D44
D49
  Bottom 0.152: AUX3.2 65.23,29.26 66.45,30.48 83.52,30.48 93.88,20.12 94.49,20.12 95.1,19.51 95.1,18.29 96.32,17.07 U1.D49
D_CLK  (via drill 0.3)
  Top 0.152: v60.96,68.28 58.52,68.28 48.77,58.52 R35.1
  Bottom 0.152: v60.96,68.28 66.45,73.76 66.45,74.37 65.84,74.98 67.06,76.2 68.28,76.2 69.49,77.42 JP6.18
D_CS  (via drill 0.3)
  Top 0.152: v60.35,67.67 59.13,67.67 51.21,59.74 51.21,58.52 R36.1
  Bottom 0.152: v60.35,67.67 67.06,67.67 73.76,74.37 73.76,76.2 72.54,77.42 JP6.20
D_DIN  (via drill 0.3)
  Top 0.152: v62.18,68.28 53.65,59.74 53.65,58.52 R37.1
  Bottom 0.152: v62.18,68.28 64.62,68.28 71.32,74.98 71.32,78.03 71.93,78.64 73.15,78.64 74.37,77.42 JP6.22
D_OUT  (via drill 0.3)
  Top 0.152: v58.52,58.52 56.08,58.52 R38.1
  Bottom 0.152: v58.52,58.52 73.76,73.76 75.59,73.76 76.2,74.37 76.2,75.59 76.81,76.2 78.64,76.2 79.86,77.42 JP6.26
D_PENIRQ
  Bottom 0.152: U1.D2 58.52,52.43 59.74,52.43 65.23,57.91 65.23,64.62 72.54,71.93 76.2,71.93 78.64,74.37 78.64,74.98 79.86,76.2 81.08,76.2 82.3,77.42 JP6.28
DB8
  Top 0.152: R14.2 64.62,72.54 64.62,74.37 JP6.13
DB9
  Top 0.152: R15.2 67.67,72.54 67.67,74.37 JP6.15
DB10
  Top 0.152: R16.2 70.1,72.54 70.1,74.37 JP6.17
DB11
  Top 0.152: R17.2 72.54,72.54 72.54,74.37 JP6.19
DB12
  Top 0.152: R20.2 74.98,72.54 74.98,74.37 JP6.21
DB13
  Top 0.152: R23.2 77.42,72.54 77.42,74.37 JP6.23
DB14
  Top 0.152: R24.2 79.86,72.54 79.86,74.37 JP6.25
DB15
  Top 0.152: R25.2 82.91,72.54 82.91,74.37 JP6.27
GND  (4 unrouted)
  pour Top (isolate 0.305): -0.38,0 0,82.42 99.95,79.76 99.69,0.25 45.34,0
  pour Bottom (isolate 0.61): 0.13,80.01 99.82,80.01 99.82,0.13 0.13,0.13 -0.13,79.88 0.13,78.74
LED
  Top 0.152: R12.2 29.26,54.86 29.26,52.43 U1.D13
N$2
  Top 0.152: LED4.A 29.26,1.83 29.26,4.88 R41.1
N$3
  Top 0.152: EXT_PWR.2 10.97,17.07 10.97,12.8 9.75,11.58 J1.1 10.36,10.97 10.36,9.14 10.97,8.53 X1.TIP
N$4
  Top 0.152: TX.C 5.49,65.23 10.36,65.23 R7.2
N$5
  Top 0.152: RSSI.A 5.49,73.76 10.36,73.76 R3.1
N$6
  Top 0.152: IC1.7 21.95,69.49 21.95,68.89 IC1.6 21.34,68.89 20.73,68.28 20.73,64.01 21.34,63.4 21.34,61.57 16.46,61.57 12.8,65.23 R7.1
N$7
  Top 0.152: PWR.A 5.49,60.96 10.36,60.96 R6.2
N$8  (via drill 0.3)
  Top 0.152: v12.19,71.32 12.19,73.15 R3.2
  Bottom 0.152: v12.19,71.32 12.19,56.08 12.8,55.47 XBEE.6
N$9
  Top 0.152: IC1.1 17.68,70.1 17.68,69.49 IC1.2 17.07,69.49 12.8,69.49 R4.1
N$10  (via drill 0.3)
  Top 0.152: v28.04,69.49 28.04,65.84 R9.1
  Bottom 0.152: v28.04,69.49 19.51,78.03 XBEE.12
N$11
  Top 0.152: RX.C 5.49,69.49 10.36,69.49 R4.2
N$12
  Top 0.152: R9.2 29.87,65.23 32.31,65.23 33.53,64.01 Q1.2
N$14  (via drill 0.3)
  Top 0.152: v44.5,44.5 45.72,44.5 R5.1 | U$6.MS1 24.38,36.58 31.09,43.28 36.58,43.28 JP4.1
  Bottom 0.152: v44.5,44.5 42.06,42.06 39.01,42.06 37.19,43.89 JP4.1
N$15
  Bottom 0.152: U$6.MS2 26.82,36.58 34.75,44.5 38.41,44.5 39.01,43.89 JP4.3
N$16
  Top 0.152: 19.51,68.28 18.9,68.89 17.68,68.89 IC1.3 | 19.51,68.28 19.51,64.01 20.73,62.79 R1.2 | 19.51,68.28 19.51,70.1 24.38,74.98 34.75,74.98 JP1.2
N$17
  Top 0.152: U$7.MS2 26.82,20.12 32.92,26.21 39.01,26.21 39.62,26.82 JP5.3
N$19
  Top 0.152: U$6.MS3 29.26,36.58 34.14,41.45 40.23,41.45 42.06,43.28 JP4.5
N$20
  Bottom 0.152: U$6.RST 32.31,35.97 34.14,35.97 U$6.SLP
N$21  (via drill 0.3)
  Top 0.152: v15.85,46.33 24.99,46.33 26.82,48.16 U$6.2B
  Bottom 0.152: 6.71,37.19 v15.85,46.33 | 6.71,37.19 5.49,37.19 4.27,35.97 JP2.1 | 6.71,37.19 X-MOT.1
N$22
  Top 0.152: U$6.2A 29.26,48.16 26.82,45.72 13.41,45.72 7.32,39.62 X-MOT.2
  Bottom 0.152: JP2.2 4.27,39.01 6.71,39.01 X-MOT.2
N$23
  Bottom 0.152: U$7.RST 32.31,20.12 34.14,20.12 U$7.SLP
N$24  (1 unrouted)
  Bottom 0.152: JP3.2 40.84,74.37 23.77,57.3 23.77,54.86 17.07,48.16 13.41,48.16 5.49,56.08 XBEE.2
N$26
  Top 0.152: U$6.1A 31.7,48.77 29.87,50.6 16.46,50.6 7.32,41.45 X-MOT.3
  Bottom 0.152: JP2.3 4.27,42.06 6.71,42.06 X-MOT.3
N$27
  Bottom 0.152: 6.71,44.5 9.14,46.94 16.46,46.94 18.29,45.11 31.09,45.11 34.14,48.16 U$6.1B | 6.71,44.5 5.49,44.5 4.27,45.72 JP2.4 | 6.71,44.5 X-MOT.4
N$28
  Bottom 0.152: U$7.2B 26.21,32.31 26.21,31.09 25.6,30.48 17.07,30.48 15.85,31.7 3.66,31.7 0.61,28.65 0.61,20.73 1.83,19.51 3.66,19.51 JP7.1 4.27,18.9 6.1,20.73 Y-MOT.1
N$29  (via drill 0.3)
  Top 0.152: v15.85,29.87 26.82,29.87 29.26,32.31 U$7.2A
  Bottom 0.152: v15.85,29.87 9.75,23.77 6.71,23.77 Y-MOT.2 6.1,23.16 4.27,23.16 JP7.2
N$30
  Top 0.152: U$7.1A 31.7,32.31 28.65,29.26 15.24,29.26 12.19,26.21 6.71,26.21 Y-MOT.3
  Bottom 0.152: JP7.3 4.27,26.21 6.1,26.21 Y-MOT.3
N$31
  Bottom 0.152: U$7.MS3 29.87,20.12 29.87,21.95 36.58,28.65 40.23,28.65 41.45,27.43 JP5.5
N$32
  Top 0.152: 21.34,60.35 28.04,60.35 R2.1 | 21.34,60.35 20.73,60.35 R1.1 | 21.34,60.35 19.51,58.52 9.75,58.52 7.32,56.08 XBEE.3
N$33
  Top 0.152: R8.1 45.11,28.65 37.8,28.65 36.58,27.43 JP5.1 36.58,26.82 31.09,26.82 24.38,20.12 U$7.MS1
N$36
  Bottom 0.152: U$7.1B 34.14,32.31 31.7,29.87 17.07,29.87 16.46,30.48 7.92,30.48 6.71,29.26 Y-MOT.4 6.1,29.26 4.27,29.26 JP7.4
N$46
  Top 0.152: LED1.A 26.82,56.69 28.65,56.69 R12.1
RESET  (via drill 0.3)
  Top 0.152: S2.3 S2.4 | v43.89,42.06 43.89,51.82 42.06,53.65 41.45,53.65 32.92,62.18 Q1.3
  Bottom 0.152: v43.89,42.06 43.89,30.48 45.11,29.26 45.11,12.8 39.01,6.71 36.58,6.71 33.53,3.66 U1.RES 32.92,4.27 31.09,2.44 S2.4
SCL  (via drill 0.3)
  Top 0.152: v87.17,37.19 88.39,37.19 R22.1 | v82.3,48.16 82.3,44.5 81.08,43.28 I2C.4
  Bottom 0.152: v87.17,37.19 81.69,42.67 I2C.4 | v82.3,48.16 85.95,51.82 U1.D21
SD_CS
  Top 0.152: R32.1 75.59,10.36 75.59,15.24 R31.1 74.98,15.24 78.64,18.9 78.64,24.38 77.42,25.6 76.81,25.6 76.2,26.21 76.2,26.82 70.1,32.92 70.1,48.77 72.54,51.21 72.54,52.43 62.18,62.79 62.18,64.62 63.4,65.84 63.4,78.03 64.01,78.64 90.83,78.64 91.44,78.03 92.66,78.03 JP6.36
SD_DIN  (via drill 0.3)
  Top 0.152: 67.67,11.58 67.67,15.24 R29.1 | 67.67,11.58 67.67,10.36 R30.1 | v64.01,31.7 70.1,25.6 70.1,16.46 70.71,15.85 70.71,14.63 67.67,11.58
  Bottom 0.152: v64.01,31.7 64.01,42.67 66.45,45.11 66.45,64.62 71.93,70.1 81.69,70.1 86.56,74.98 86.56,75.59 87.17,76.2 88.39,76.2 89.61,77.42 JP6.34
SD_SCK
  Top 0.152: 81.69,12.19 81.69,15.24 R34.1 | 81.69,12.19 81.69,10.36 R33.1 | 81.69,12.19 84.73,12.19 90.22,6.71 96.93,6.71 99.36,9.14 99.36,28.04 96.93,30.48 93.88,30.48 92.05,32.31 92.05,49.38 93.27,50.6 93.88,50.6 95.1,51.82 95.1,52.43 89,58.52 89,74.98 87.78,76.2 87.78,77.42 JP6.32
SDA
  Top 0.152: 86.56,46.33 84.12,48.77 84.12,51.82 U1.D20 | 86.56,46.33 88.39,44.5 R21.1 | 86.56,46.33 86.56,45.72 81.69,40.84 I2C.3
SPI_MISO
  Bottom 0.152: 63.4,26.21 64.01,25.6 80.47,25.6 81.08,26.21 81.08,26.82 82.3,28.04 82.91,28.04 84.73,26.21 84.73,23.77 93.88,14.63 U1.D50 | 63.4,26.21 62.79,26.82 AUX3.3 | 63.4,26.21 63.4,42.67 65.84,45.11 65.84,64.62 71.93,70.71 77.42,70.71 81.08,74.37 81.08,74.98 82.3,76.2 83.52,76.2 84.73,77.42 JP6.30
SPI_MOSI
  Top 0.152: R29.2 68.89,15.24 68.89,23.16 65.23,26.82 AUX3.4
  Bottom 0.152: U1.D51 96.32,14.63 95.1,14.63 94.49,15.24 93.88,15.24 85.34,23.77 85.34,26.82 82.3,29.87 67.06,29.87 64.62,27.43 64.62,26.82 AUX3.4
SPI_SCK  (via drill 0.3)
  Top 0.152: 83.52,15.24 90.22,15.24 93.88,11.58 U1.D52 | v81.69,17.07 83.52,15.24 | 83.52,15.24 R34.2
  Bottom 0.152: v81.69,17.07 73.76,17.07 68.28,22.55 64.01,22.55 62.79,23.77 AUX3.5
SPI_SS
  Top 0.152: R31.2 78.64,15.24 81.08,17.68 88.39,17.68 93.27,12.8 95.1,12.8 96.32,11.58 U1.D53
TFT_CS
  Top 0.152: R27.2 85.34,72.54 85.34,74.37 JP6.29
TFT_LEDA
  Top 0.152: R26.2 95.1,72.54 95.1,74.37 JP6.37
TFT_RD
  Top 0.152: R13.2 62.18,72.54 62.18,74.37 JP6.11
TFT_REST
  Top 0.152: R28.2 90.22,72.54 90.22,74.37 JP6.33
TFT_RS
  Top 0.152: R10.2 57.3,72.54 57.3,74.37 JP6.7
TFT_WR
  Top 0.152: R11.2 59.74,72.54 59.74,74.37 JP6.9
X-DIR  (via drill 0.3)
  Top 0.152: v44.5,13.41 53.65,4.27 U1.A1
  Bottom 0.152: v44.5,13.41 44.5,16.46 43.28,17.68 43.28,32.31 39.62,35.97 U$6.DIR
X-EN  (via drill 0.3)
  Top 0.152: U$6.EN 21.34,35.97 22.55,34.75 29.87,34.75 30.48,35.36 30.48,36.58 32.31,38.41 42.06,38.41 R18.2 42.67,39.01 v49.38,39.01
  Bottom 0.152: v49.38,39.01 58.52,29.87 58.52,4.27 U1.A3
X-MAX
  Top 0.152: U1.D17 76.2,51.82 73.76,49.38 73.76,43.28 X+.1
X-MIN
  Top 0.152: U1.D16 73.15,51.82 73.15,45.72 70.71,43.28 X-.1
X-STEP
  Bottom 0.152: U$6.STEP 37.19,36.58 43.28,42.67 44.5,42.67 50.6,36.58 50.6,4.27 U1.A0
XBEE_ON  (via drill 0.3)
  Top 0.152: v12.8,63.4 12.8,60.96 R6.1
  Bottom 0.152: v12.8,63.4 12.8,73.76 17.07,78.03 XBEE.13
Y-DIR
  Top 0.152: U$7.DIR 39.62,20.12 43.89,20.12 59.74,4.27 59.74,3.66 61.57,1.83 67.06,1.83 68.89,3.66 U1.A7
Y-EN  (via drill 0.3)
  Top 0.152: R19.2 21.95,21.95 21.95,20.12 U$7.EN | v43.89,15.85 55.47,4.27 U1.A2
  Bottom 0.152: v43.89,15.85 29.87,15.85 26.82,18.9 23.77,18.9 22.55,20.12 21.95,20.12 U$7.EN
Y-MAX
  Top 0.152: U1.D15 70.71,51.82 70.71,49.99 69.49,48.77 69.49,44.5 68.28,43.28 Y+.1
Y-MIN
  Top 0.152: U1.D14 68.89,51.82 68.89,46.33 65.84,43.28 Y-.1
Y-STEP
  Top 0.152: U$7.STEP 37.19,20.12 39.01,21.95 44.5,21.95 62.18,4.27 62.18,3.66 63.4,2.44 64.62,2.44 65.84,3.66 U1.A6

### Text on the board
tNames: 8 | MS1 | MS1 | MS2 | MS3 | 8
bNames: + | + | + | +
_tsilk: END STOPS | 1 | S | X | - | + | + | AUX-2 | +